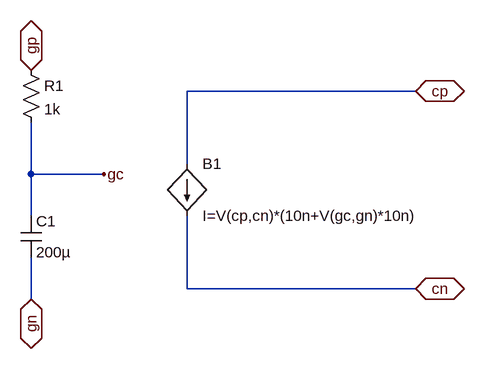
[diagram p0: schematic Jauge_Graphite.asc]
Jauge_Graphite.asc, the LTspice schematic file:
Version 4
SHEET 1 880 680
WIRE 384 16 32 16
WIRE 32 128 32 16
WIRE -208 144 -208 64
WIRE -96 144 -208 144
WIRE -208 208 -208 144
WIRE 32 320 32 208
WIRE 384 320 32 320
WIRE -208 336 -208 272
FLAG 384 16 cp
IOPIN 384 16 BiDir
FLAG 384 320 cn
IOPIN 384 320 BiDir
FLAG -208 -16 gp
IOPIN -208 -16 BiDir
FLAG -208 336 gn
IOPIN -208 336 BiDir
FLAG -96 144 gc
SYMBOL bi 32 128 R0
SYMATTR InstName B1
SYMATTR Value I=V(cp,cn)*(10n+V(gc,gn)*10n)
SYMBOL res -224 -32 R0
SYMATTR InstName R1
SYMATTR Value 1k
SYMBOL cap -224 208 R0
SYMATTR InstName C1
SYMATTR Value 200µ

The netlist it stands for:
* Jauge_Graphite.asc
B1 cp cn I=V(cp,cn)*(10n+V(gc,gn)*10n)
R1 gp gc 1k
C1 gc gn 200µ
.backanno
.end